# EAGLE board interfacez_r2_1 (EAGLE 6.4), part 1 of 2
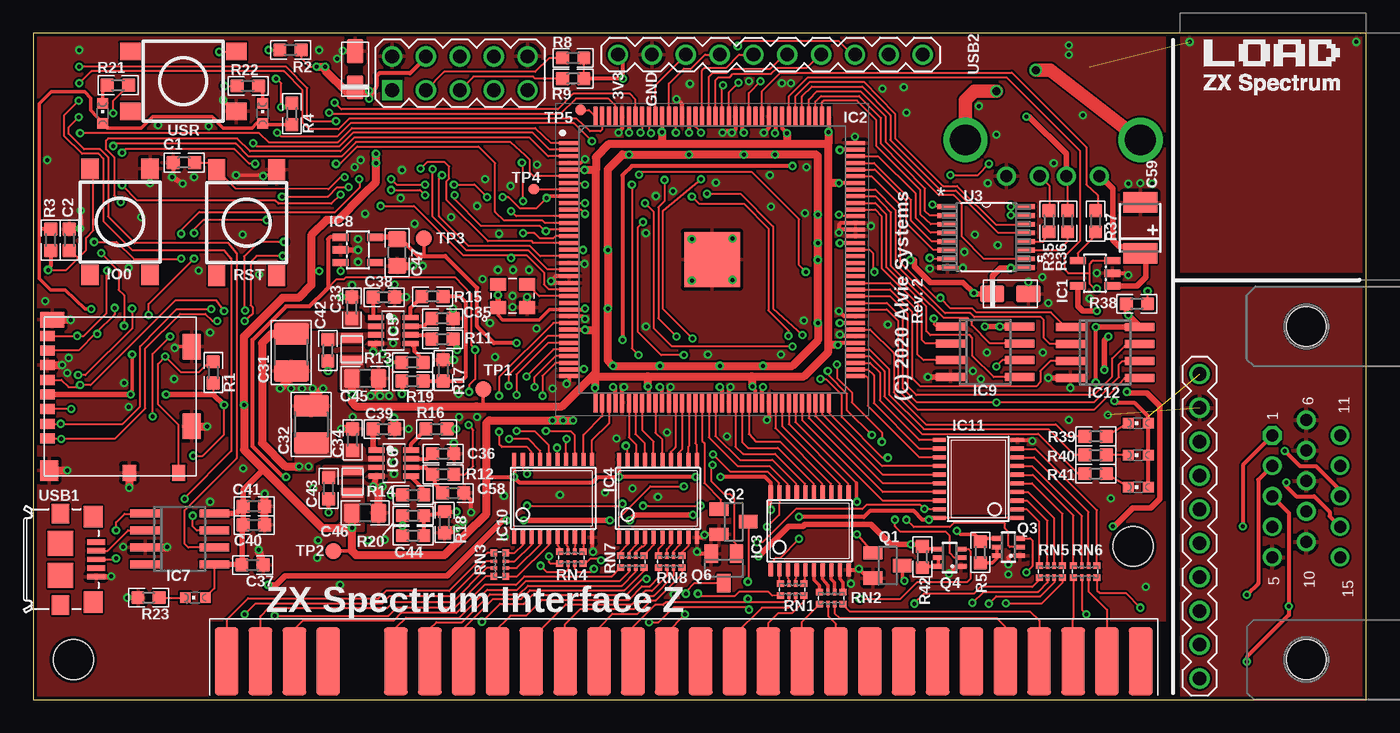
[diagram p3: board, top side]
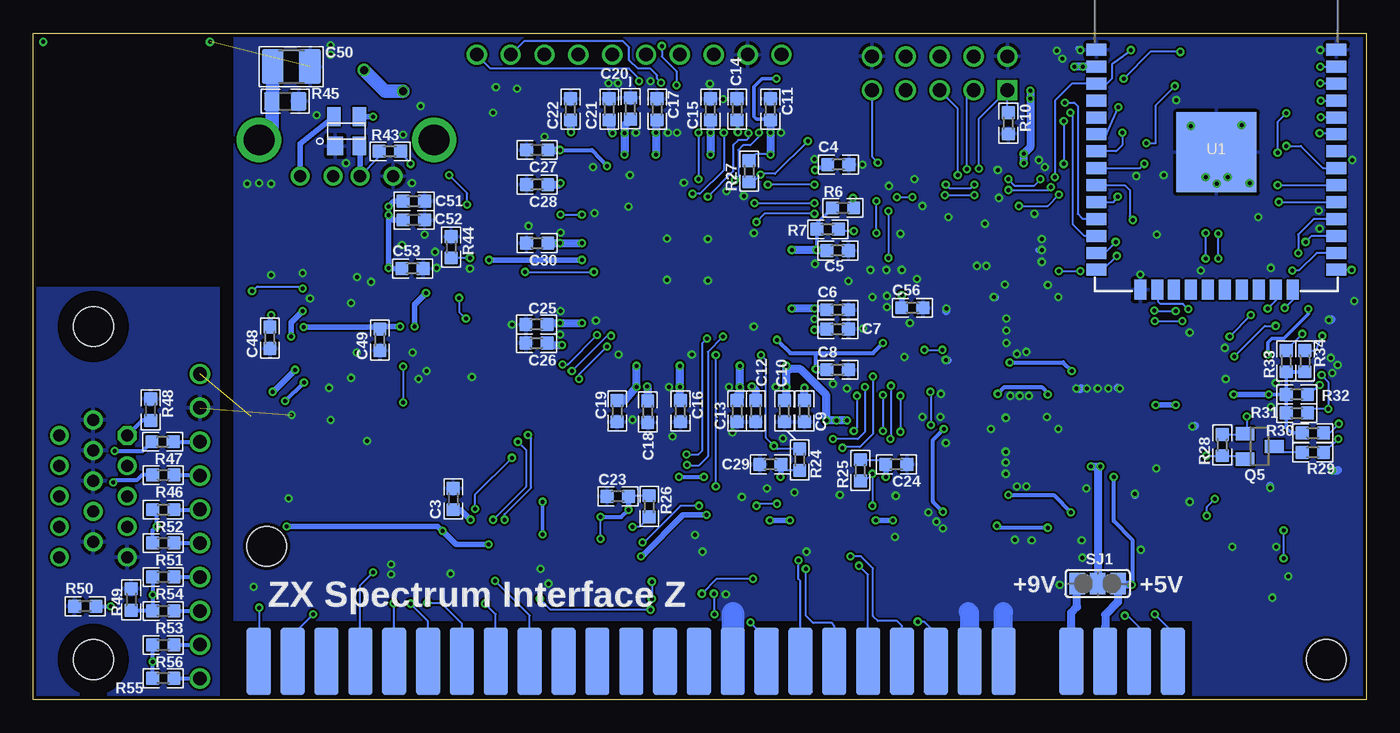
[diagram p4: board, bottom side, seen from below]

Size 100 x 50 mm. Coordinates in mm from the lower left corner, seen from the top.
Outline: 0,50 0,0 100,0 100,50 0,50
Copper layers (1*16): Top 0.035mm / dielectric 1.5mm / Bottom 0.035mm
Design rules "JLCPCB-Single-DualLayer": minimum track width 5mil, minimum drill 0.3mm, track to track 6mil, track to pad 6mil, pad to pad 6mil, via to via 6mil, smd to smd 0mil, copper to edge 10mil, drill to drill 10mil, minimum pad ring 10mil, minimum via ring 6mil, stop-mask expansion 2mil, vias tented up to drill 100mil, thermal gap 10mil
Holes 3 mm at 3,3 82.5,11.5
tRestrict: area 85,0 to 86,50; area 86,31 to 100,32
bRestrict: area 85,0 to 86,50; area 86,31 to 100,32

## Footprints (pad centres in the part's own frame; a part is rotated, then mirrored left to right if it is on the bottom)
0603 = smd 1 x 1: 1 -0.8,0; 2 0.8,0
1210 = smd 1.6 x 2.6: 1 -1.4,0; 2 1.4,0
0805 = smd 1.2 x 1.4: 1 -1,0; 2 1,0
TANT_CASE_A = smd 1.8 x 1.23: MINUS 1.355,0; PLUS -1.355,0
TE-B-3528 = smd 1.524 x 2.54: + 1.905,0; - -1.905,0
ZX-EDGE-DAUGHTERBOARD = smd 1.778 x 5.08 bottom: A1 6.35,-1.27; A2 3.81,-1.27; A3 1.27,-1.27; A4 -1.27,-1.27; A6 -6.35,-1.27; A7 -8.89,-1.27; A8 -11.43,-1.27; A9 -13.97,-1.27; A10 -16.51,-1.27; A11 -19.05,-1.27; A12 -21.59,-1.27; A13 -24.13,-1.27; A14 -26.67,-1.27; A15 -29.21,-1.27; A16 -31.75,-1.27; A17 -34.29,-1.27; A18 -36.83,-1.27; A19 -39.37,-1.27; A20 -41.91,-1.27; A21 -44.45,-1.27; A22 -46.99,-1.27; A23 -49.53,-1.27; A24 -52.07,-1.27; A25 -54.61,-1.27; A26 -57.15,-1.27; A27 -59.69,-1.27; A28 -62.23,-1.27 | smd 1.778 x 5.08: B1 6.35,-1.27; B2 3.81,-1.27; B3 1.27,-1.27; B4 -1.27,-1.27; B6 -6.35,-1.27; B7 -8.89,-1.27; B8 -11.43,-1.27; B9 -13.97,-1.27; B10 -16.51,-1.27; B11 -19.05,-1.27; B12 -21.59,-1.27; B13 -24.13,-1.27; B14 -26.67,-1.27; B15 -29.21,-1.27; B16 -31.75,-1.27; B17 -34.29,-1.27; B18 -36.83,-1.27; B19 -39.37,-1.27; B20 -41.91,-1.27; B21 -44.45,-1.27; B22 -46.99,-1.27; B23 -49.53,-1.27; B24 -52.07,-1.27; B25 -54.61,-1.27; B26 -57.15,-1.27; B27 -59.69,-1.27; B28 -62.23,-1.27
PIN-2X5 = drill 1.016 square: 1 -5.08,-1.27 | drill 1.016: 2 -5.08,1.27; 3 -2.54,-1.27; 4 -2.54,1.27; 5 0,-1.27; 6 0,1.27; 7 2.54,-1.27; 8 2.54,1.27; 9 5.08,-1.27; 10 5.08,1.27
SOT23-5L = smd 0.55 x 1.2: 1 -0.95,-1.3; 2 0,-1.3; 3 0.95,-1.3; 4 0.95,1.3; 5 -0.95,1.3
QFP50P2200X2200X165-145N = smd 1.475 x 0.3: 1 -10.738,8.75; 2 -10.738,8.25; 3 -10.738,7.75; 4 -10.738,7.25; 5 -10.738,6.75; 6 -10.738,6.25; 7 -10.738,5.75; 8 -10.738,5.25; 9 -10.738,4.75; 10 -10.738,4.25; 11 -10.738,3.75; 12 -10.738,3.25; 13 -10.738,2.75; 14 -10.738,2.25; 15 -10.738,1.75; 16 -10.738,1.25; 17 -10.738,0.75; 18 -10.738,0.25; 19 -10.738,-0.25; 20 -10.738,-0.75; 21 -10.738,-1.25; 22 -10.738,-1.75; 23 -10.738,-2.25; 24 -10.738,-2.75; 25 -10.738,-3.25; 26 -10.738,-3.75; 27 -10.738,-4.25; 28 -10.738,-4.75; 29 -10.738,-5.25; 30 -10.738,-5.75; 31 -10.738,-6.25; 32 -10.738,-6.75; 33 -10.738,-7.25; 34 -10.738,-7.75; 35 -10.738,-8.25; 36 -10.738,-8.75; 73 10.738,-8.75; 74 10.738,-8.25; 75 10.738,-7.75; 76 10.738,-7.25; 77 10.738,-6.75; 78 10.738,-6.25; 79 10.738,-5.75; 80 10.738,-5.25; 81 10.738,-4.75; 82 10.738,-4.25; 83 10.738,-3.75; 84 10.738,-3.25; 85 10.738,-2.75; 86 10.738,-2.25; 87 10.738,-1.75; 88 10.738,-1.25; 89 10.738,-0.75; 90 10.738,-0.25; 91 10.738,0.25; 92 10.738,0.75; 93 10.738,1.25; 94 10.738,1.75; 95 10.738,2.25; 96 10.738,2.75; 97 10.738,3.25; 98 10.738,3.75; 99 10.738,4.25; 100 10.738,4.75; 101 10.738,5.25; 102 10.738,5.75; 103 10.738,6.25; 104 10.738,6.75; 105 10.738,7.25; 106 10.738,7.75; 107 10.738,8.25; 108 10.738,8.75 | smd 0.3 x 1.475: 37 -8.75,-10.738; 38 -8.25,-10.738; 39 -7.75,-10.738; 40 -7.25,-10.738; 41 -6.75,-10.738; 42 -6.25,-10.738; 43 -5.75,-10.738; 44 -5.25,-10.738; 45 -4.75,-10.738; 46 -4.25,-10.738; 47 -3.75,-10.738; 48 -3.25,-10.738; 49 -2.75,-10.738; 50 -2.25,-10.738; 51 -1.75,-10.738; 52 -1.25,-10.738; 53 -0.75,-10.738; 54 -0.25,-10.738; 55 0.25,-10.738; 56 0.75,-10.738; 57 1.25,-10.738; 58 1.75,-10.738; 59 2.25,-10.738; 60 2.75,-10.738; 61 3.25,-10.738; 62 3.75,-10.738; 63 4.25,-10.738; 64 4.75,-10.738; 65 5.25,-10.738; 66 5.75,-10.738; 67 6.25,-10.738; 68 6.75,-10.738; 69 7.25,-10.738; 70 7.75,-10.738; 71 8.25,-10.738; 72 8.75,-10.738; 109 8.75,10.738; 110 8.25,10.738; 111 7.75,10.738; 112 7.25,10.738; 113 6.75,10.738; 114 6.25,10.738; 115 5.75,10.738; 116 5.25,10.738; 117 4.75,10.738; 118 4.25,10.738; 119 3.75,10.738; 120 3.25,10.738; 121 2.75,10.738; 122 2.25,10.738; 123 1.75,10.738; 124 1.25,10.738; 125 0.75,10.738; 126 0.25,10.738; 127 -0.25,10.738; 128 -0.75,10.738; 129 -1.25,10.738; 130 -1.75,10.738; 131 -2.25,10.738; 132 -2.75,10.738; 133 -3.25,10.738; 134 -3.75,10.738; 135 -4.25,10.738; 136 -4.75,10.738; 137 -5.25,10.738; 138 -5.75,10.738; 139 -6.25,10.738; 140 -6.75,10.738; 141 -7.25,10.738; 142 -7.75,10.738; 143 -8.25,10.738; 144 -8.75,10.738 | smd 4.15 x 4.15: 145 0,0
TSSOP20 = smd 0.305 x 0.991: 1 -2.925,-2.918; 2 -2.275,-2.918; 3 -1.625,-2.918; 4 -0.975,-2.918; 5 -0.325,-2.918; 6 0.325,-2.918; 7 0.975,-2.918; 8 1.625,-2.918; 9 2.275,-2.918; 10 2.925,-2.918; 11 2.925,2.918; 12 2.275,2.918; 13 1.625,2.918; 14 0.975,2.918; 15 0.325,2.918; 16 -0.325,2.918; 17 -0.975,2.918; 18 -1.625,2.918; 19 -2.275,2.918; 20 -2.925,2.918
SOT23-8L = smd 0.4 x 1.2: 1 -0.975,-1.3; 2 -0.325,-1.3; 3 0.325,-1.3; 4 0.975,-1.3; 5 0.975,1.3; 6 0.325,1.3; 7 -0.325,1.3; 8 -0.975,1.3
SOIC8 = smd 0.6 x 2.2: 1 -1.905,-2.6; 2 -0.635,-2.6; 3 0.635,-2.6; 4 1.905,-2.6; 5 1.905,2.6; 6 0.635,2.6; 7 -0.635,2.6; 8 -1.905,2.6
IND_0806 = smd 0.7 x 1.6: P$1 -0.85,0; P$2 0.85,0
LED-603 = smd 0.8 x 0.8: A 0,-0.75; C 0,0.75
SOT23 = smd 1 x 1.4: 1 -0.95,-1.1; 2 0.95,-1.1; 3 0,1.1
SC70-6 = smd 0.35 x 0.8: 1 -0.65,-0.85; 2 0,-0.85; 3 0.65,-0.85; 4 0.65,0.85; 5 0,0.85; 6 -0.65,0.85
EXB28V = smd 0.525 x 0.5: 1 -0.875,-0.45; 4 0.875,-0.45; 5 0.875,0.45; 8 -0.875,0.45 | smd 0.25 x 0.5: 2 -0.25,-0.45; 3 0.25,-0.45; 6 0.25,0.45; 7 -0.25,0.45
TACTILE_SWITCH_TALL = smd 1.55 x 1.3: A1 -3.975,-2.25; A2 3.975,-2.25; B1 -3.975,2.25; B2 3.975,2.25
1040310811 = smd 0.75 x 1.1: 1 3.155,-5.45; 2 2.055,-5.45; 3 0.955,-5.45; 4 -0.145,-5.45; 5 -1.245,-5.45; 6 -2.345,-5.45; 7 -3.445,-5.45; 8 -4.545,-5.45 | smd 1.2 x 1: A 5.74,4.4; B 5.74,0.7 | smd 1.9 x 1.35: MNT1 -3.73,5.375; MNT2 2.24,5.375 | smd 1.17 x 1.8: MNT3 -5.755,-5.1 | smd 1.55 x 1.35: MNT4 5.565,-5.325
SJ_2 = smd 1.168 x 1.6: 1 -1.524,0; 2 0,0; 3 1.524,0
TP12R = smd 1.2 x 1.2: TP 0,0
TP08R = smd 0.8 x 0.8: TP 0,0
SP0503 = smd 1.2 x 1.4: 1 -0.85,-1.1 | smd 1 x 1.4: 2 0.95,-1.1; 3 0.95,1.1; 4 -0.95,1.1
ESP-WROOM-32 = smd 0.9 x 1.5: 1 7.7,9; 2 6.43,9; 3 5.16,9; 4 3.89,9; 5 2.62,9; 6 1.35,9; 7 0.08,9; 8 -1.19,9; 9 -2.46,9; 10 -3.73,9; 11 -5,9; 12 -6.27,9; 13 -7.54,9; 14 -8.81,9; 25 -8.81,-9; 26 -7.54,-9; 27 -6.27,-9; 28 -5,-9; 29 -3.73,-9; 30 -2.46,-9; 31 -1.19,-9; 32 0.08,-9; 33 1.35,-9; 34 2.62,-9; 35 3.89,-9; 36 5.16,-9; 37 6.43,-9; 38 7.7,-9 | smd 1.5 x 0.9: 15 -10.3,5.715; 16 -10.3,4.445; 17 -10.3,3.175; 18 -10.3,1.905; 19 -10.3,0.635; 20 -10.3,-0.635; 21 -10.3,-1.905; 22 -10.3,-3.175; 23 -10.3,-4.445; 24 -10.3,-5.715 | smd 6 x 6: GND 0,0
SOP65P640X120-16N = smd 1.473 x 0.356: 1 -2.921,2.286; 2 -2.921,1.626; 3 -2.921,0.965; 4 -2.921,0.33; 5 -2.921,-0.33; 6 -2.921,-0.965; 7 -2.921,-1.626; 8 -2.921,-2.286; 9 2.921,-2.286; 10 2.921,-1.626; 11 2.921,-0.965; 12 2.921,-0.33; 13 2.921,0.33; 14 2.921,0.965; 15 2.921,1.626; 16 2.921,2.286
KC3225K = smd 1.2 x 0.95: 1 -1.1,-0.875; 2 1.1,-0.875; 3 1.1,0.875; 4 -1.1,0.875
PIN-1X10 = drill 1.016: 1 -11.43,0; 2 -8.89,0; 3 -6.35,0; 4 -3.81,0; 5 -1.27,0; 6 1.27,0; 7 3.81,0; 8 6.35,0; 9 8.89,0; 10 11.43,0
CONN_USB_MICRO-B = smd 1.6 x 1.4: BODY@1 -3.2,2.45; BODY@2 3.2,2.45 | smd 1.45 x 1.3: BODY@3 3.425,0; BODY@6 -3.425,0 | smd 1.9 x 1.9: BODY@4 1.2,0; BODY@5 -1.2,0 | smd 0.4 x 1.35: P1 -1.3,2.675; P2 -0.65,2.675; P3 0,2.675; P4 0.65,2.675; P5 1.3,2.675
USB-A-H = drill 0.914: D+ 2.718,-1.003; D- 2.718,1.003; GND 2.718,-3.493; VBUS 2.718,3.493 | drill 2.311: P$5 0,-6.566; P$6 0,6.566
HDF15H = drill 0.9 octagon: 1 4.329,2.54 | drill 0.9: 2 2.043,2.54; 3 -0.243,2.54; 4 -2.529,2.54; 5 -4.815,2.54; 6 5.472,0; 7 3.186,0; 8 0.9,0; 9 -1.386,0; 10 -3.672,0; 11 4.329,-2.54; 12 2.043,-2.54; 13 -0.243,-2.54; 14 -2.529,-2.54; 15 -4.815,-2.54 | hole 3: -12.5,0; 12.5,0

## Placement (x,y rotation side)
C1  1nF  [0603]  11.3,40.3 0 top
C2  1nF  [0603]  2.7,34.5 270 top
C3  100nF 6.3V  [0603]  68.5,15.05 90 bottom
C4  100nF 6.3V  [0603]  39.6,40.15 0 bottom
C5  100nF 6.3V  [0603]  39.65,33.7 0 bottom
C6  100nF 6.3V  [0603]  39.65,29.25 0 bottom
C7  100nF 6.3V  [0603]  39.65,27.8 0 bottom
C8  100nF 6.3V  [0603]  39.65,24.75 0 bottom
C9  100nF 6.3V  [0603]  42.15,21.65 270 bottom
C10  100nF 6.3V  [0603]  43.65,21.65 270 bottom
C11  100nF 6.3V  [0603]  44.7,44.3 90 bottom
C12  100nF 6.3V  [0603]  45.8,21.65 270 bottom
C13  100nF 6.3V  [0603]  47.2,21.65 270 bottom
C14  100nF 6.3V  [0603]  47.2,44.3 90 bottom
C15  100nF 6.3V  [0603]  49.2,44.3 90 bottom
C16  100nF 6.3V  [0603]  51.45,21.65 270 bottom
C17  100nF 6.3V  [0603]  53.2,44.3 90 bottom
C18  100nF 6.3V  [0603]  53.9,21.6 270 bottom
C19  100nF 6.3V  [0603]  56.2,21.65 270 bottom
C20  100nF 6.3V  [0603]  55.2,44.35 90 bottom
C21  100nF 6.3V  [0603]  56.8,44.3 90 bottom
C22  100nF 6.3V  [0603]  59.7,44.3 90 bottom
C23  100nF 6.3V  [0603]  56.15,15.25 180 bottom
C24  100nF 6.3V  [0603]  35.25,17.65 0 bottom
C25  100nF 6.3V  [0603]  62.25,28.15 180 bottom
C26  100nF 6.3V  [0603]  62.25,26.75 180 bottom
C27  100nF 6.3V  [0603]  62.2,41.25 180 bottom
C28  100nF 6.3V  [0603]  62.2,38.65 180 bottom
C29  100nF 6.3V  [0603]  44.7,17.65 180 bottom
C30  100nF 6.3V  [0603]  62.2,34.25 180 bottom
C31  22uF 16V  [1210]  19.35,26.05 90 top
C32  22uF 16V  [1210]  20.85,20.65 270 top
C33  100nF 16V  [0603]  23.9,29.4 270 top
C34  100nF 16V  [0603]  23.95,19.5 270 top
C35  100nF 16V  [0603]  30.7,28.6 180 top
C36  100nF 16V  [0603]  30.75,18.45 180 top
C37  1uF  [0603]  16.45,10.1 0 top
C38  22nF 6.3V  [0603]  26.3,30.2 180 top
C39  22nF 6.3V  [0603]  26.3,20.3 180 top
C40  10uF  [0603]  16.55,13.1 0 top
C41  100nF 6.3V  [0603]  16.55,14.5 0 top
C42  100nF 6.3V  [0603]  22.1,26.2 270 top
C43  100nF 6.3V  [0603]  22.15,15.85 270 top
C44  15pF  [0603]  28.5,12.3 180 top
C45  22uF 6.3V TBD  [0805]  24.9,24.1 180 top
C46  22uF 6.3V TBD  [0805]  24.9,14 180 top
C47  10uF 6.3V TBD  [0805]  27.3,33.55 90 top
C48  100nF 6.3V  [0603]  82.25,27.15 90 bottom
C49  100nF 6.3V  [0603]  74,27 90 bottom
C50  1000pF 2KV  [1210]  80.65,47.5 0 bottom
C51  100nF 6.3V  [0603]  71.45,37.4 0 bottom
C52  100nF 6.3V  [0603]  71.45,36 0 bottom
C53  100nF 6.3V  [0603]  71.55,32.35 0 bottom
C56  100nF 6.3V  [0603]  34.05,29.4 0 bottom
C57  47uF 6.3V TANT  [TANT_CASE_A]  24.15,47.3 90 top
C58  100nF/DNP  [0603]  31.5,15.5 180 top
C59  TAJB107M010RNJ  [TE-B-3528]  83.05,35.4 270 top
C60  47uF 6.3V TANT  [TANT_CASE_A]  73.3,30.45 0 top
CONN1  ZX_EDGE_DAUGHTERBOARD  [ZX-EDGE-DAUGHTERBOARD]  20.86,1.6 180 top
CONN2  PIN-2X5  [PIN-2X5]  32,47 0 top
IC1  STMPS2141STR  [SOT23-5L]  79.65,32 90 top
IC2  EP4CE6E22C8N  [QFP50P2200X2200X165-145N]  50.92,33.02 0 top
IC3  74LCX245FT  [TSSOP20]  58.25,12.65 0 top
IC4  74LCX245FT  [TSSOP20]  46.87,15.09 0 top
IC5  MP2233DJ  [SOT23-8L]  27,27.7 270 top
IC6  MP2233DJ  [SOT23-8L]  27.05,17.75 270 top
IC7  CH330N  [SOIC8]  10.98,12.05 270 top
IC8  MIC5504-2.5YM5-TR  [SOT23-5L]  24.35,33.75 270 top
IC9  LY68L6400SLIT  [SOIC8]  71.4,26.1 270 top
IC10  74LCX245FT  [TSSOP20]  39,15.1 0 top
IC11  74LCX245FT  [TSSOP20]  70.9,16.55 90 top
IC12  LY68L6400SLIT  [SOIC8]  80.4,26.05 270 top
L1  VLS201610HBXR68-M1  [IND_0806]  23.9,26.3 270 top
L2  VLS201610HBX1R5-M1  [IND_0806]  23.95,16.35 270 top
LED1  LG L29K-G2J1-24  [LED-603]  5.2,44 0 top
LED2  LG L29K-G2J1-24  [LED-603]  17.2,44 0 top
LED3  LG L29K-G2J1-24  [LED-603]  12.15,7.65 90 top
LED4  LG L29K-G2J1-24  [LED-603]  82.9,20.75 90 top
LED5  LG L29K-G2J1-24  [LED-603]  82.9,18.35 90 top
LED6  LG L29K-G2J1-24  [LED-603]  82.9,15.95 90 top
Q1  BSS123  [SOT23]  64.09,10.06 270 top
Q2  BSS123  [SOT23]  52.54,13.34 270 top
Q3  CJ3439KDW  [SC70-6]  73.15,11.45 90 top
Q4  CJ3439KDW  [SC70-6]  68.75,10.65 90 top
Q5  BSS84  [SOT23]  8,19 270 bottom
Q6  BSS123  [SOT23]  51.8,9.85 180 top
R1  10K  [0603]  13.5,24.55 90 top
R2  10K  [0603]  19.3,48.75 0 top
R3  10K  [0603]  1.3,34.5 90 top
R4  10K  [0603]  19.4,43.95 270 top
R5  10K  [0603]  71.05,11.05 270 top
R6  10K  [0603]  39.25,36.9 180 bottom
R7  10K  [0603]  40.4,35.3 180 bottom
R8  10K  [0603]  40.5,48.15 0 top
R9  10K  [0603]  40.5,46.6 0 top
R10  10K  [0603]  26.85,43.25 270 bottom
R11  140K  [0603]  30.7,27.05 0 top
R12  140K  [0603]  30.75,16.9 0 top
R13  20R  [0603]  28.45,25.3 0 top
R14  20R  [0603]  28.5,15.35 0 top
R15  140K  [0603]  29.95,30.25 0 top
R16  24K  [0603]  30.25,20.3 0 top
R17  61K9  [0603]  30.75,24.7 270 top
R18  13K  [0603]  30.85,13.3 90 top
R19  30K1  [0603]  28.45,23.9 180 top
R20  40K2  [0603]  28.5,13.8 180 top
R21  2K2  [0603]  6.35,46.1 0 top
R22  2K2  [0603]  16.1,46.05 180 top
R23  2K2  [0603]  8.65,7.65 180 top
R24  100K  [0603]  42.5,18 90 bottom
R25  100K  [0603]  37.95,17.2 270 bottom
R26  100K  [0603]  53.8,14.5 270 bottom
R27  10K  [0603]  46.3,39.65 90 bottom
R28  10K  [0603]  10.8,19.1 90 bottom
R29  10K  [0603]  4,18.55 0 bottom
R30  10K  [0603]  4,20 180 bottom
R31  10K  [0603]  5.2,21.5 180 bottom
R32  10K  [0603]  5.2,22.9 180 bottom
R33  10K  [0603]  6,25.4 270 bottom
R34  10K  [0603]  4.6,25.4 270 bottom
R35  33  [0603]  76.2,35.9 90 top
R36  33  [0603]  77.6,35.9 90 top
R37  100R  [0603]  79.7,35.9 90 top
R38  100K  [0603]  82.8,29.7 180 top
R39  2K2  [0603]  79.7,19.75 180 top
R40  2K2  [0603]  79.7,18.35 180 top
R41  2K2  [0603]  79.7,16.95 180 top
R42  10K  [0603]  66.7,10.7 270 top
R43  1.5k  [0603]  73.25,41.15 180 bottom
R44  10k  [0603]  68.65,33.95 270 bottom
R45  1M  [0805]  81.1,44.9 0 bottom
R46  82R5  [0603]  90.25,16.85 180 bottom
R47  82R5  [0603]  90.3,19.35 180 bottom
R48  130R  [0603]  91.2,21.75 270 bottom
R49  130R  [0603]  92.65,7.5 270 bottom
R50  130R  [0603]  96.1,7 0 bottom
R51  520R  [0603]  90.25,11.75 180 bottom
R52  270R  [0603]  90.25,14.25 180 bottom
R53  520R  [0603]  90.25,6.65 180 bottom
R54  270R  [0603]  90.25,9.2 180 bottom
R55  520R  [0603]  90.25,1.6 180 bottom
R56  270R  [0603]  90.25,4.1 180 bottom
RN1  330R  [EXB28V]  56.94,8.26 0 top
RN2  330R  [EXB28V]  59.87,7.61 0 top
RN3  330R  [EXB28V]  34.99,10.12 270 top
RN4  330R  [EXB28V]  40.37,10.65 0 top
RN5  330R  [EXB28V]  76.34,9.6 0 top
RN6  330R  [EXB28V]  78.92,9.6 0 top
RN7  33R  [EXB28V]  44.95,10.36 0 top
RN8  33R  [EXB28V]  47.78,10.36 0 top
S1  SWITCHES_SMD-4  [TACTILE_SWITCH_TALL]  16,35.8 90 top
S2  SWITCHES_SMD-4  [TACTILE_SWITCH_TALL]  6.5,35.85 90 top
S3  SWITCHES_SMD-4  [TACTILE_SWITCH_TALL]  11.25,46.4 0 top
SD1  1040310811  [1040310811]  6.5,22.75 270 top
SJ1  [SJ_2]  20.15,8.7 180 bottom
TP1  TPTP12R  [TP12R]  33.75,23.3 0 top
TP2  TPTP12R  [TP12R]  22.5,11.15 0 top
TP3  TPTP12R  [TP12R]  29.3,34.6 0 top
TP4  TPTP08R  [TP08R]  37.55,38.3 0 top
TP5  TPTP08R  [TP08R]  41.05,44.25 0 top
TV26  SP0503BAHT  [SP0503]  76.5,42.65 0 bottom
U1  ESP-WROOM-32  [ESP-WROOM-32]  11.24,41.06 90 bottom
U3  TUSB1106PWR  [SOP65P640X120-16N]  71.5,34.7 0 top
U$1  KC3225K-32MHz  [KC3225K]  35.95,30.3 0 top
U$2  PIN-1X10  [PIN-1X10]  87.5,13 270 top
U$7  PIN-1X10  [PIN-1X10]  55.3,48.4 0 top
USB1  CON-USB-F-MICRO-B  [CONN_USB_MICRO-B]  2.04,10.52 270 top
USB2  USB-A-H  [USB-A-H]  76.5,42 270 top
X1  [HDF15H]  95.5,15.5 90 top